# EAGLE design haystack_nano (EAGLE 9.1.0)
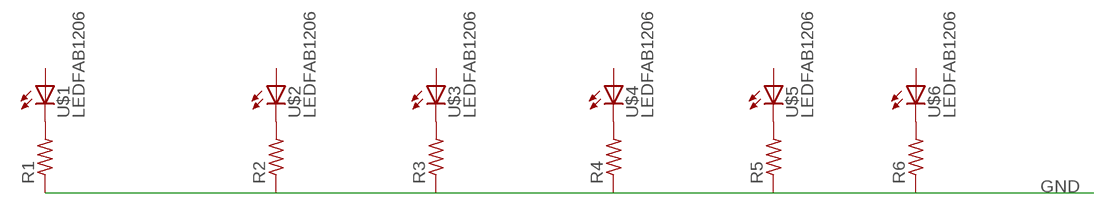
[diagram p0: schematic, sheet 1]

## Parts
R1  RES-US1206  [R1206]
R2  RES-US1206  [R1206]
R3  RES-US1206  [R1206]
R4  RES-US1206  [R1206]
R5  RES-US1206  [R1206]
R6  RES-US1206  [R1206]
U$1  LEDFAB1206  [LED1206FAB]
U$2  LEDFAB1206  [LED1206FAB]
U$3  LEDFAB1206  [LED1206FAB]
U$4  LEDFAB1206  [LED1206FAB]
U$5  LEDFAB1206  [LED1206FAB]
U$6  LEDFAB1206  [LED1206FAB]

## Nets
GND: R1.1 R2.1 R3.1 R4.1 R5.1 R6.1
N$1: R1.2 U$1.2(C)
N$2: R2.2 U$2.2(C)
N$3: R3.2 U$3.2(C)
N$4: R5.2 U$5.2(C)
N$5: R6.2 U$6.2(C)
N$6: R4.2 U$4.2(C)
Unconnected: U$1.1(A) U$2.1(A) U$3.1(A) U$4.1(A) U$5.1(A) U$6.1(A)

## Library data of the parts
R1-R6 = fab :RES-US: Resistor (US Symbol) Variants with postfix FAB are widened to allow the routing of internal traces
U$1-U$6 = fab :LED: LED

## Board
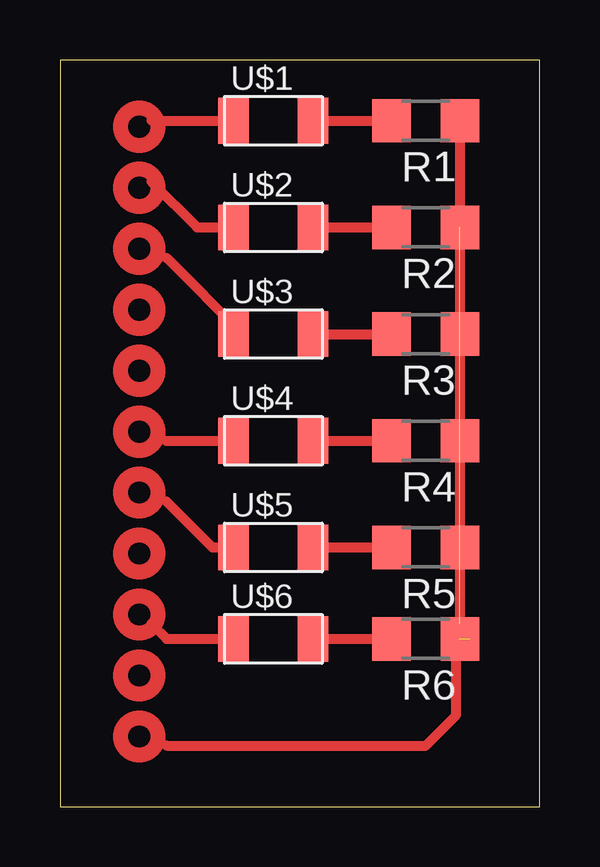
[diagram p1: board, top side]
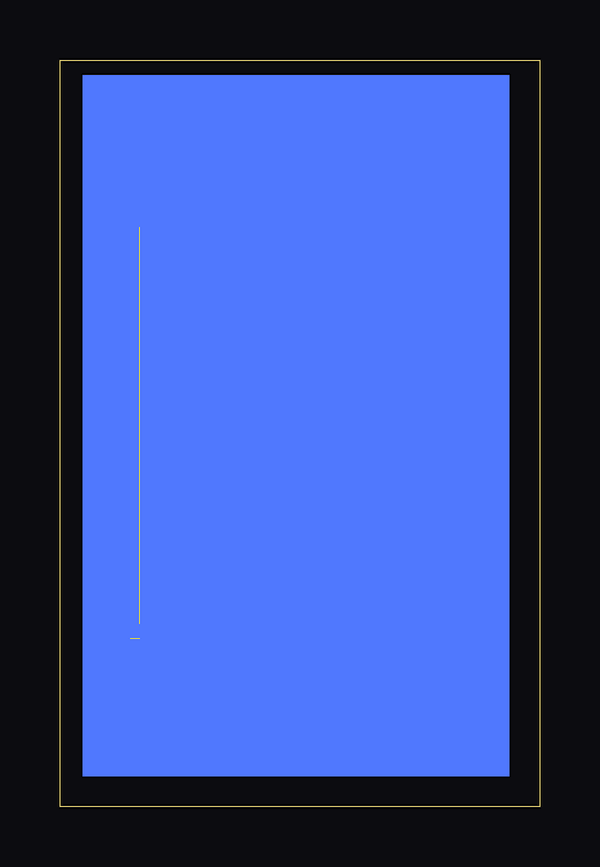
[diagram p2: board, bottom side, seen from below]

Size 19.99 x 31.11 mm. Coordinates in mm from the lower left corner, seen from the top.
Outline: 0,0 19.99,0 19.99,31.11 0,31.11 0,0
Copper layers (1*16): Top 0.035mm / dielectric 1.5mm / Bottom 0.035mm
Design rules "default": minimum track width 6mil, minimum drill 0.35mm, track to track 6mil, track to pad 6mil, pad to pad 6mil, via to via 6mil, smd to smd 6mil, copper to edge 40mil, drill to drill 6mil, minimum pad ring 10mil, minimum via ring 8mil, stop-mask expansion 4mil, vias tented up to drill 0mil, thermal gap 10mil

### Footprints (pad centres in the part's own frame; a part is rotated, then mirrored left to right if it is on the bottom)
R1206 = smd 1.6 x 1.803: 1 -1.422,0; 2 1.422,0
LED1206FAB = smd 1.27 x 1.905: 1 -1.651,0; 2 1.651,0

### Placement (x,y rotation side)
R1  15.24,28.57 180 top
R2  15.24,24.13 180 top
R3  15.24,19.68 180 top
R4  15.24,15.24 180 top
R5  15.24,10.79 180 top
R6  15.24,6.99 180 top
U$1  8.89,28.57 0 top
U$2  8.89,24.13 0 top
U$3  8.89,19.68 0 top
U$4  8.89,15.24 0 top
U$5  8.89,10.79 0 top
U$6  8.89,6.99 0 top

### Tracks (layer width: path | path; a pad name or v marks a point on that pad's centre or on a via)
GND  (5 unrouted)
  Top 0.406: 17.07,6.99 17.07,7.22 16.66,7.62 R1.1
N$1
  Top 0.406: U$1.2 R1.2
N$2
  Top 0.406: U$2.2 R2.2
N$3
  Top 0.406: U$3.2 R3.2
N$4
  Top 0.406: U$5.2 R5.2
N$5
  Top 0.406: U$6.2 R6.2
N$6
  Top 0.406: U$4.2 R4.2
N$7
  Top 0.406: 3.81,28.57 6.99,28.57 7.62,27.94
N$8
  Top 0.406: 3.81,26.04 5.71,24.13 6.99,24.13
N$9
  Top 0.406: 4.45,22.86 7.62,19.68
N$10
  Top 0.406: 4.45,15.24 6.99,15.24
N$11
  Top 0.406: 4.45,12.7 6.35,10.79 6.99,10.79
N$12
  Top 0.406: 3.81,7.62 4.45,6.99 6.99,6.99
N$13
  Top 0.406: 4.45,2.54 15.24,2.54 16.51,3.81 16.51,6.99
(copper drawn outside any net)
  shapes: Bottom area x1, Top circle x11